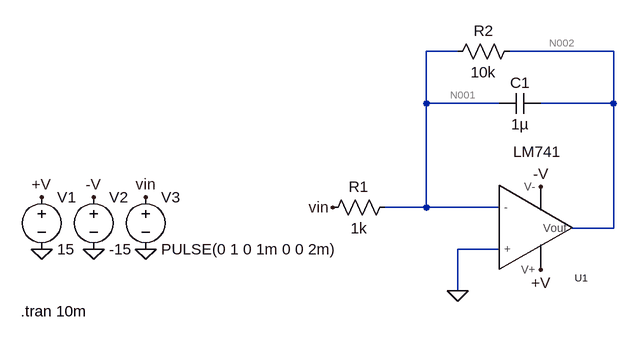
[diagram p0: schematic integrator.asc]
integrator.asc, the LTspice schematic file:
Version 4.1
SHEET 1 880 680
WIRE 176 -112 128 -112
WIRE 416 -112 256 -112
WIRE 128 -32 128 -112
WIRE 240 -32 128 -32
WIRE 416 -32 416 -112
WIRE 416 -32 304 -32
WIRE 128 128 128 -32
WIRE 128 128 64 128
WIRE 240 128 128 128
WIRE 416 160 416 -32
WIRE 416 160 352 160
WIRE 240 192 176 192
WIRE 176 256 176 192
FLAG 176 256 0
FLAG -464 192 0
FLAG -384 192 0
FLAG -304 192 0
FLAG -464 112 +V
FLAG 304 224 +V
FLAG -384 112 -V
FLAG 304 96 -V
FLAG -304 112 vin
FLAG -16 128 vin
SYMBOL LM\ 741\\LM741 288 144 M180
SYMATTR InstName U1
SYMBOL res 80 112 R90
WINDOW 0 0 56 VBottom 2
WINDOW 3 32 56 VTop 2
SYMATTR InstName R1
SYMATTR Value 1k
SYMBOL voltage -464 96 R0
WINDOW 123 0 0 Left 0
WINDOW 39 0 0 Left 0
SYMATTR InstName V1
SYMATTR Value 15
SYMBOL voltage -384 96 R0
WINDOW 123 0 0 Left 0
WINDOW 39 0 0 Left 0
SYMATTR InstName V2
SYMATTR Value -15
SYMBOL voltage -304 96 R0
WINDOW 123 0 0 Left 0
WINDOW 39 0 0 Left 0
SYMATTR InstName V3
SYMATTR Value PULSE(0 1 0 1m 0 0 2m)
SYMBOL res 272 -128 R90
WINDOW 0 0 56 VBottom 2
WINDOW 3 32 56 VTop 2
SYMATTR InstName R2
SYMATTR Value 10k
SYMBOL cap 304 -48 R90
WINDOW 0 0 32 VBottom 2
WINDOW 3 32 32 VTop 2
SYMATTR InstName C1
SYMATTR Value 1µ
TEXT -496 288 Left 2 !.tran 10m

The netlist it stands for:
* integrator.asc
X§U1 0 N001 +V -V N002 LM741  ; pins + - V+ V- Vout
R1 N001 vin 1k
V1 +V 0 15
V2 -V 0 -15
V3 vin 0 PULSE(0 1 0 1m 0 0 2m)
R2 N002 N001 10k
C1 N002 N001 1µ
.tran 10m
.lib C:\Users\Subodha\Desktop\Desk\2nd Semester\Electronics\LT Spices\Unity gain amplifier\LM 741\lm741.lib
.backanno
.end

* Results of the author's LTspice run, read from the files saved beside the schematic
* Operating Point, zero values left out:
*   V(+v) = 15 V
*   V(n002) = 12.02 mV
*   V(n001) = 1 mV
*   V(-v) = -15 V
*   I(R1) = 1 µA
*   I(V3) = 1 µA
*   I(V1) = -1.702 mA
*   I(R2) = 1.102 µA
*   I(V2) = 1.701 mA
*   Ix(u1:1) = 57.86 nA
*   Ix(u1:2) = 101.9 nA
*   Ix(u1:99) = 1.702 mA
*   Ix(u1:50) = -1.701 mA
*   Ix(u1:28) = -1.102 µA
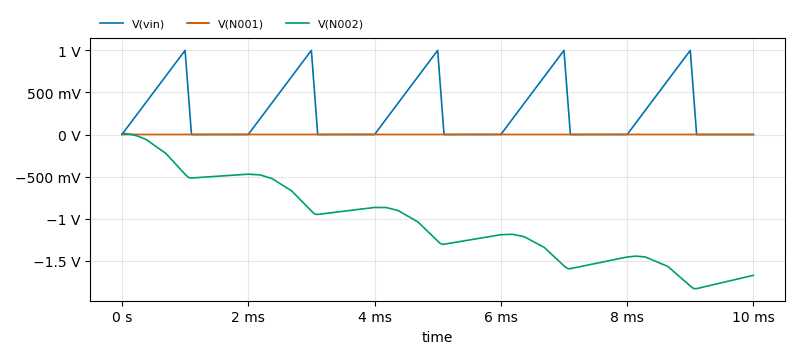
[diagram p1: Transient Analysis of integrator.asc, plotted from the saved traces]
* Transient Analysis, 1 run:
*   V(vin): min 0 V, max 1 V, average 275 mV, rms 436.6 mV, last 0 V
*   V(N001): min 687.3 µV, max 1.162 mV, average 1.032 mV, rms 1.034 mV, last 981.6 µV
*   V(N002): min -1.833 V, max 12.05 mV, average -1.056 V, rms 1.17 V, last -1.672 V